# EAGLE design rotary sewing (EAGLE 9.5.2)
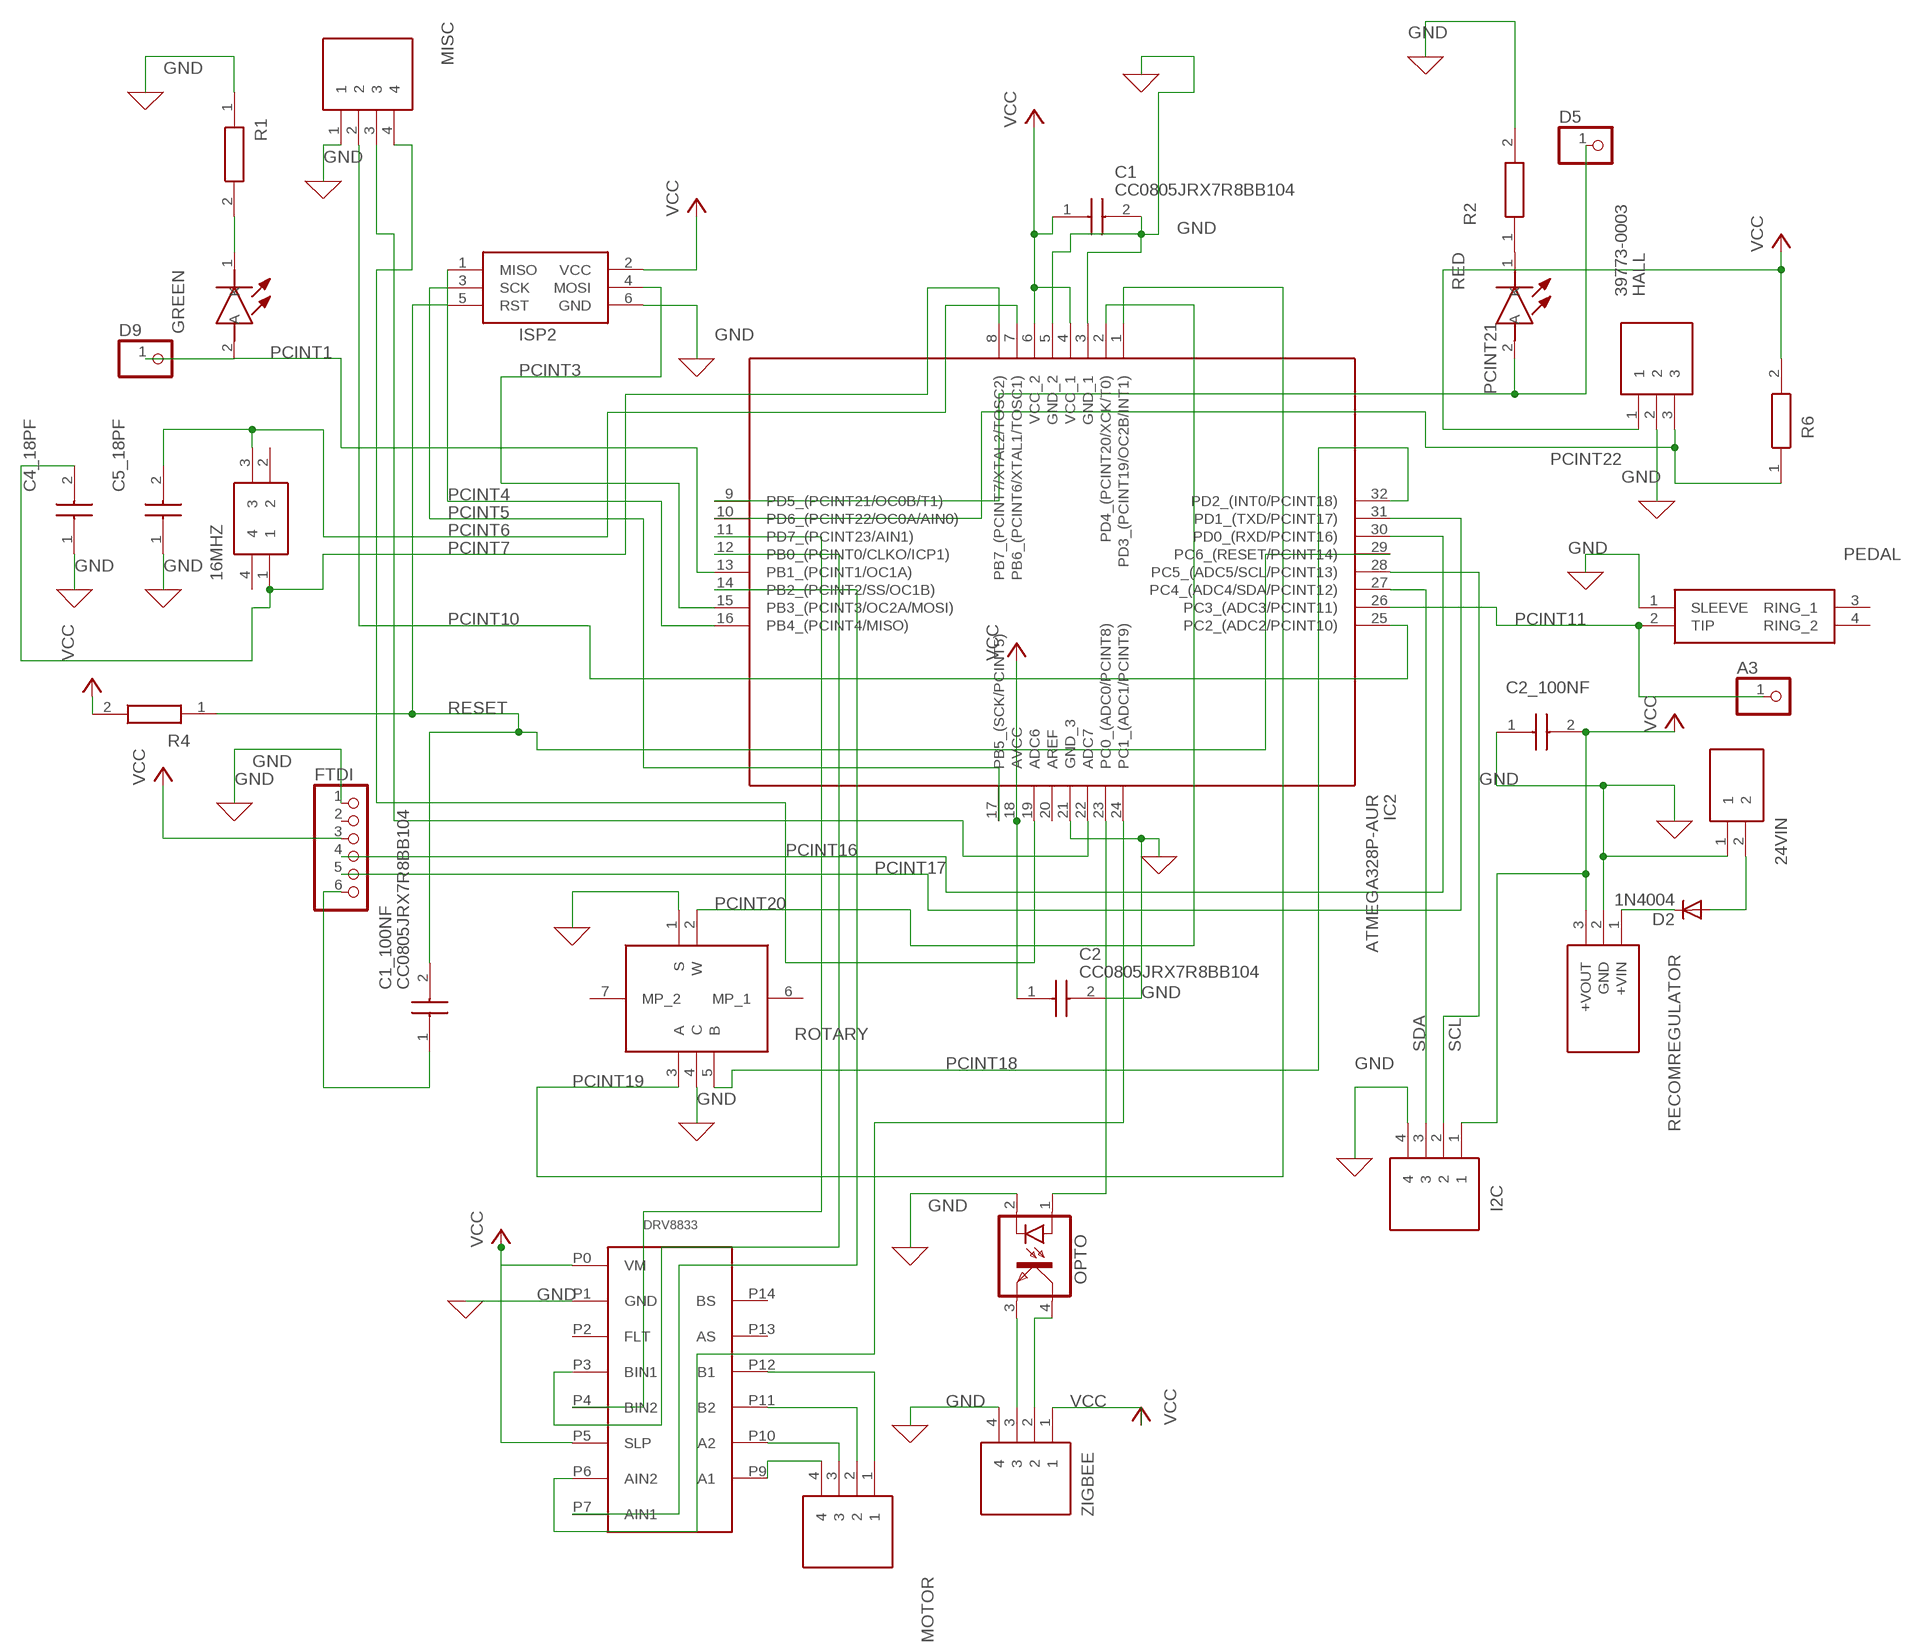
[diagram p0: schematic, sheet 1]

## Parts
16MHZ  403C11E16M00000  [403C1XA32M00000]
24VIN  39773-0002  [SHDR2W110P0X254_1X2_554X650X10]
A3  PINHD-1X1  [1X01]
C1  CC0805JRX7R8BB104  [CAPC2012X135N]
C1_100NF  CC0805JRX7R8BB104  [CAPC2012X135N]
C2  CC0805JRX7R8BB104  [CAPC2012X135N]
C2_100NF  CC0805JRX7R8BB104  [CAPC2012X135N]
C4_18PF  C0805C180J5GACTU  [CAPC2012X88N]
C5_18PF  C0805C180J5GACTU  [CAPC2012X88N]
D2  1N4004  [DO41-10]
D5  PINHD-1X1  [1X01]
D9  PINHD-1X1  [1X01]
DRV8833  DRV8833  [DRV8833]
FTDI  PINHD-1X6  [1X06]
GREEN  LTST-C171GKT  [LEDC2012X90N]
HALL  39773-0003  [SHDR3W80P0X254_1X3_808X650X101]
I2C  39773-0004  [SHDR4W80P0X254_1X4_1062X650X10]
IC2  ATMEGA328P-AUR  [QFP80P900X900X120-32N]
ISP2  AVRISP-6  [AVRISP]
MISC  39773-0004  [SHDR4W80P0X254_1X4_1062X650X10]
MOTOR  39773-0004  [SHDR4W80P0X254_1X4_1062X650X10]
OPTO  PC817  [DIL04]
PEDAL  SJ2-3574A-SMT-TR  [SJ23574ASMTTR]
R1  RMC1_10K1001FTP  [RESC2012X65N]
R2  RMC1_10K1001FTP  [RESC2012X65N]
R4  ERA-6AED103V  [RESC2012X60N]
R6  ERA-6AED103V  [RESC2012X60N]
RECOMREGULATOR  R-78E3.3-1.0  [R-78E3.3-1.0]
RED  LTST-C171KRKT  [LEDM2012X90N]
ROTARY  PEC11L-4220F-S0015  [PEC11L4220FS0015]
ZIGBEE  39773-0004  [SHDR4W80P0X254_1X4_1062X650X10]

## Nets
GND: 24VIN.1 C1.2 C2.2 C2_100NF.1 C4_18PF.1 C5_18PF.1 DRV8833.P1(GND) FTDI.1 HALL.2 I2C.4 IC2.3(GND_1) IC2.5(GND_2) IC2.21(GND_3) ISP2.6(GND) MISC.1 OPTO.2(C) PEDAL.1(SLEEVE) R1.1 R2.2 RECOMREGULATOR.2(GND) ROTARY.1(S) ROTARY.4(C) ZIGBEE.4
N$1: OPTO.3(EMIT) ZIGBEE.3
N$2: IC2.23(PC0_(ADC0/PCINT8)) OPTO.1(A)
N$3: OPTO.4(COL) ZIGBEE.2
N$4: 24VIN.2 D2.A
N$5: R2.1 RED.1(K)
N$6: GREEN.1(K) R1.2
N$7: DRV8833.P9(A1) MOTOR.4
N$8: DRV8833.P10(A2) MOTOR.3
N$9: DRV8833.P11(B2) MOTOR.2
N$10: DRV8833.P12(B1) MOTOR.1
N$11: C1_100NF.1 FTDI.6
N$12: DRV8833.P4(BIN2) IC2.11(PD7_(PCINT23/AIN1))
N$13: D2.C RECOMREGULATOR.1(+VIN)
N$14: DRV8833.P3(BIN1) IC2.12(PB0_(PCINT0/CLKO/ICP1))
N$15: DRV8833.P7(AIN1) IC2.14(PB2_(PCINT2/SS/OC1B))
N$16: DRV8833.P6(AIN2) IC2.24(PC1_(ADC1/PCINT9))
N$17: IC2.22(ADC7) MISC.3
N$19: IC2.19(ADC6) MISC.4
PCINT1: D9.1 GREEN.2(A) IC2.13(PB1_(PCINT1/OC1A))
PCINT3: IC2.15(PB3_(PCINT3/OC2A/MOSI)) ISP2.4(MOSI)
PCINT4: IC2.16(PB4_(PCINT4/MISO)) ISP2.1(MISO)
PCINT5: IC2.17(PB5_(SCK/PCINT5)) ISP2.3(SCK)
PCINT6: 16MHZ.3 C5_18PF.2 IC2.7(PB6_(PCINT6/XTAL1/TOSC1))
PCINT7: 16MHZ.1 C4_18PF.2 IC2.8(PB7_(PCINT7/XTAL2/TOSC2))
PCINT10: IC2.25(PC2_(ADC2/PCINT10)) MISC.2
PCINT11: A3.1 IC2.26(PC3_(ADC3/PCINT11)) PEDAL.2(TIP)
PCINT16: FTDI.4 IC2.30(PD0_(RXD/PCINT16))
PCINT17: FTDI.5 IC2.31(PD1_(TXD/PCINT17))
PCINT18: IC2.32(PD2_(INT0/PCINT18)) ROTARY.5(B)
PCINT19: IC2.1(PD3_(PCINT19/OC2B/INT1)) ROTARY.3(A)
PCINT20: IC2.2(PD4_(PCINT20/XCK/T0)) ROTARY.2(W)
PCINT21: D5.1 IC2.9(PD5_(PCINT21/OC0B/T1)) RED.2(A)
PCINT22: HALL.3 IC2.10(PD6_(PCINT22/OC0A/AIN0)) R6.1
RESET: C1_100NF.2 IC2.29(PC6_(RESET/PCINT14)) ISP2.5(RST) R4.1
SCL: I2C.2 IC2.28(PC5_(ADC5/SCL/PCINT13))
SDA: I2C.3 IC2.27(PC4_(ADC4/SDA/PCINT12))
VCC: C1.1 C2.1 C2_100NF.2 DRV8833.P0(VM) DRV8833.P5(SLP) FTDI.3 HALL.1 I2C.1 IC2.4(VCC_1) IC2.6(VCC_2) IC2.18(AVCC) ISP2.2(VCC) R4.2 R6.2 RECOMREGULATOR.3(+VOUT) ZIGBEE.1
Unconnected: 16MHZ.2 16MHZ.4 DRV8833.P2(FLT) DRV8833.P13(AS) DRV8833.P14(BS) FTDI.2 IC2.20(AREF) PEDAL.3(RING_1) PEDAL.4(RING_2) ROTARY.6(MP_1) ROTARY.7(MP_2)

## Library data of the parts
16MHZ = SamacSys_Parts:403C11E16M00000: Crystals 16MHz 10ppm 20pF Source: Datasheet <https://componentsearchengine.com/Datasheets/1/403C11E16M00000.pdf>; DESCRIPTION: Crystals 16MHz 10ppm 20pF; HEIGHT: 0mm; MANUFACTURER_NAME: CTS; MANUFACTURER_PART_NUMBER: 403C11E16M00000; MOUSER_PART_NUMBER: 774-403C11E16M0; MOUSER_PRICE-STOCK: https://www.mouser.com/Search/Refine.aspx?Keyword=774-403C11E16M0
24VIN = SamacSys_Parts:39773-0002: Fixed Terminal Blocks 2.54mm Eurostyle Fxd TB Mnt PCB 2Ckt Grn Source: Datasheet <https://componentsearchengine.com/Datasheets/1/39773-0002.pdf>; DESCRIPTION: Fixed Terminal Blocks 2.54mm Eurostyle Fxd TB Mnt PCB 2Ckt Grn; HEIGHT: 10mm; MANUFACTURER_NAME: Molex; MANUFACTURER_PART_NUMBER: 39773-0002; MOUSER_PART_NUMBER: 538-39773-0002; MOUSER_PRICE-STOCK: https://www.mouser.com/Search/Refine.aspx?Keyword=538-39773-0002
A3 D5 D9 = adafruit:PINHD-1X1: Pin header 1x1 for 0.1" spacing With round pins
C1 C1_100NF C2 C2_100NF = SamacSys_Parts:CC0805JRX7R8BB104: Multilayer Ceramic Capacitors MLCC - SMD/SMT 100nF 25V X7R 5% Source: Datasheet <https://componentsearchengine.com/Datasheets/1/CC0805JRX7R8BB104.pdf>; DESCRIPTION: Multilayer Ceramic Capacitors MLCC - SMD/SMT 100nF 25V X7R 5%; HEIGHT: 1.35mm; MANUFACTURER_NAME: YAGEO (PHYCOMP); MANUFACTURER_PART_NUMBER: CC0805JRX7R8BB104; MOUSER_PART_NUMBER: 603-CC805JRX7R8BB104; MOUSER_PRICE-STOCK: https://www.mouser.com/Search/Refine.aspx?Keyword=603-CC805JRX7R8BB104
C4_18PF C5_18PF = SamacSys_Parts:C0805C180J5GACTU: CAPACITOR, 0805 18pF +/-5% 50V Source: Datasheet <https://componentsearchengine.com/Datasheets/1/C0805C180J5GACTU.pdf>; DESCRIPTION: CAPACITOR, 0805 18pF +/-5% 50V; HEIGHT: 0.88mm; MANUFACTURER_NAME: Kemet; MANUFACTURER_PART_NUMBER: C0805C180J5GACTU; MOUSER_PART_NUMBER: 80-C0805C180J5G; MOUSER_PRICE-STOCK: https://www.mouser.com/Search/Refine.aspx?Keyword=80-C0805C180J5G
D2 = adafruit:1N4004: DIODE General purpose 1N400x type rectifier (With bigger pads) http://www.ladyada.net/library/pcb/eaglelibrary.html
DRV8833 = customs:DRV8833
FTDI = adafruit:PINHD-1X6: PIN HEADER
GREEN = SamacSys_Parts:LTST-C171GKT: Lite-On LTST-C171GKT, CHIPLED 0805 569 nm Green LED, 2012 (0805) SMD package Source: Datasheet <https://componentsearchengine.com/Datasheets/1/LTST-C171GKT.pdf>; DESCRIPTION: Lite-On LTST-C171GKT, CHIPLED 0805 569 nm Green LED, 2012 (0805) SMD package; HEIGHT: 0.9mm; MANUFACTURER_NAME: Lite-On; MANUFACTURER_PART_NUMBER: LTST-C171GKT; MOUSER_PART_NUMBER: 859-LTST-C171GKT; MOUSER_PRICE-STOCK: https://www.mouser.com/Search/Refine.aspx?Keyword=859-LTST-C171GKT
HALL = SamacSys_Parts:39773-0003: Fixed Terminal Blocks 2.54mm Eurostyle Fxd TB Mnt PCB 3Ckt Grn Source: Datasheet <https://componentsearchengine.com/Datasheets/1/39773-0003.pdf>; DESCRIPTION: Fixed Terminal Blocks 2.54mm Eurostyle Fxd TB Mnt PCB 3Ckt Grn; HEIGHT: 10.1mm; MANUFACTURER_NAME: Molex; MANUFACTURER_PART_NUMBER: 39773-0003; MOUSER_PART_NUMBER: 538-39773-0003; MOUSER_PRICE-STOCK: https://www.mouser.com/Search/Refine.aspx?Keyword=538-39773-0003
I2C MISC MOTOR ZIGBEE = SamacSys_Parts:39773-0004: Fixed Terminal Blocks 2.54mm Eurostyle Fxd TB Mnt PCB 4Ckt Grn Source: Datasheet <https://componentsearchengine.com/Datasheets/1/39773-0004.pdf>; DESCRIPTION: Fixed Terminal Blocks 2.54mm Eurostyle Fxd TB Mnt PCB 4Ckt Grn; HEIGHT: 10.1mm; MANUFACTURER_NAME: Molex; MANUFACTURER_PART_NUMBER: 39773-0004; MOUSER_PART_NUMBER: 538-39773-0004; MOUSER_PRICE-STOCK: https://www.mouser.com/Search/Refine.aspx?Keyword=538-39773-0004
IC2 = SamacSys_Parts:ATMEGA328P-AUR: 8-bit Microcontrollers - MCU AVR 32K FLSH 2K SRAM 1KB EE-20MHz IND Source: Datasheet <https://componentsearchengine.com/Datasheets/1/ATMEGA328P-AUR.pdf>; DESCRIPTION: 8-bit Microcontrollers - MCU AVR 32K FLSH 2K SRAM 1KB EE-20MHz IND; HEIGHT: 1.2mm; MANUFACTURER_NAME: Microchip; MANUFACTURER_PART_NUMBER: ATMEGA328P-AUR; MOUSER_PART_NUMBER: 556-ATMEGA328P-AUR; MOUSER_PRICE-STOCK: https://www.mouser.com/Search/Refine.aspx?Keyword=556-ATMEGA328P-AUR
ISP2 = adafruit:AVRISP: AVR ISP HEADER Standard 6 pin header for AVR programming
OPTO = optocoupler:PC817: SHARP OPTO COUPLER; MPN: PC817X4J000F; OC_FARNELL: 9707727; OC_NEWARK: 97K7059
PEDAL = SamacSys_Parts:SJ2-3574A-SMT-TR: Phone Connectors 3.5mm Audio Jack SMT 4 conductor 0 switch Source: Datasheet <https://componentsearchengine.com/Datasheets/1/SJ2-3574A-SMT-TR.pdf>; DESCRIPTION: Phone Connectors 3.5mm Audio Jack SMT 4 conductor 0 switch; HEIGHT: 5mm; MANUFACTURER_NAME: CUI; MANUFACTURER_PART_NUMBER: SJ2-3574A-SMT-TR; MOUSER_PART_NUMBER: 490-SJ2-3574A-SMT-TR; MOUSER_PRICE-STOCK: https://www.mouser.com/Search/Refine.aspx?Keyword=490-SJ2-3574A-SMT-TR
R1 R2 = SamacSys_Parts:RMC1_10K1001FTP: Thick Film Resistors - SMD 0805 1K00 1% Source: Datasheet <https://componentsearchengine.com/Datasheets/1/RMC1_10K1001FTP.pdf>; DESCRIPTION: Thick Film Resistors - SMD 0805 1K00 1%; HEIGHT: 0.65mm; MANUFACTURER_NAME: Kamaya; MANUFACTURER_PART_NUMBER: RMC1/10K1001FTP; MOUSER_PART_NUMBER: 791-RMC1/10K1001FTP; MOUSER_PRICE-STOCK: https://www.mouser.com/Search/Refine.aspx?Keyword=791-RMC1%2F10K1001FTP
R4 R6 = SamacSys_Parts:ERA-6AED103V: Thin Film Resistors - SMD 0805 10Kohms 25ppm 0.5% AEC-Q200 Source: Datasheet <https://componentsearchengine.com/Datasheets/1/ERA-6AED103V.pdf>; DESCRIPTION: Thin Film Resistors - SMD 0805 10Kohms 25ppm 0.5% AEC-Q200; HEIGHT: 0.6mm; MANUFACTURER_NAME: Panasonic; MANUFACTURER_PART_NUMBER: ERA-6AED103V; MOUSER_PART_NUMBER: 667-ERA-6AED103V; MOUSER_PRICE-STOCK: https://www.mouser.com/Search/Refine.aspx?Keyword=667-ERA-6AED103V
RECOMREGULATOR = SamacSys_Parts:R-78E3.3-1.0: Recom DC-DC Switching Regulator, 7 28V dc Input, 3.3V Output, 1A Source: Datasheet <https://componentsearchengine.com/Datasheets/1/R-78E3.3-1.0.pdf>; DESCRIPTION: Recom DC-DC Switching Regulator, 7 28V dc Input, 3.3V Output, 1A; HEIGHT: mm; MANUFACTURER_NAME: RECOM Power; MANUFACTURER_PART_NUMBER: R-78E3.3-1.0; MOUSER_PART_NUMBER: 919-R-78E3.3-1.0; MOUSER_PRICE-STOCK: https://www.mouser.com/Search/Refine.aspx?Keyword=919-R-78E3.3-1.0
RED = SamacSys_Parts:LTST-C171KRKT: Lite-On LTST-C171KRKT, CHIPLED 0805 631 nm Red LED, 2012 (0805) SMD package Source: Datasheet <https://componentsearchengine.com/Datasheets/1/LTST-C171KRKT.pdf>; DESCRIPTION: Lite-On LTST-C171KRKT, CHIPLED 0805 631 nm Red LED, 2012 (0805) SMD package; HEIGHT: 0.9mm; MANUFACTURER_NAME: Lite-On; MANUFACTURER_PART_NUMBER: LTST-C171KRKT; MOUSER_PART_NUMBER: 859-LTST-C171KRKT; MOUSER_PRICE-STOCK: https://www.mouser.com/Search/Refine.aspx?Keyword=859-LTST-C171KRKT
ROTARY = SamacSys_Parts:PEC11L-4220F-S0015: BOURNS - PEC11L-4220F-S0015 - INCREMENTAL ENCODER, 15 PULSES Source: Datasheet <https://componentsearchengine.com/Datasheets/1/PEC11L-4220F-S0015.pdf>; DESCRIPTION: BOURNS - PEC11L-4220F-S0015 - INCREMENTAL ENCODER, 15 PULSES; HEIGHT: 25mm; MANUFACTURER_NAME: Bourns; MANUFACTURER_PART_NUMBER: PEC11L-4220F-S0015; MOUSER_PART_NUMBER: 652-PEC11L4220FS0015; MOUSER_PRICE-STOCK: https://www.mouser.com/Search/Refine.aspx?Keyword=652-PEC11L4220FS0015

## Board
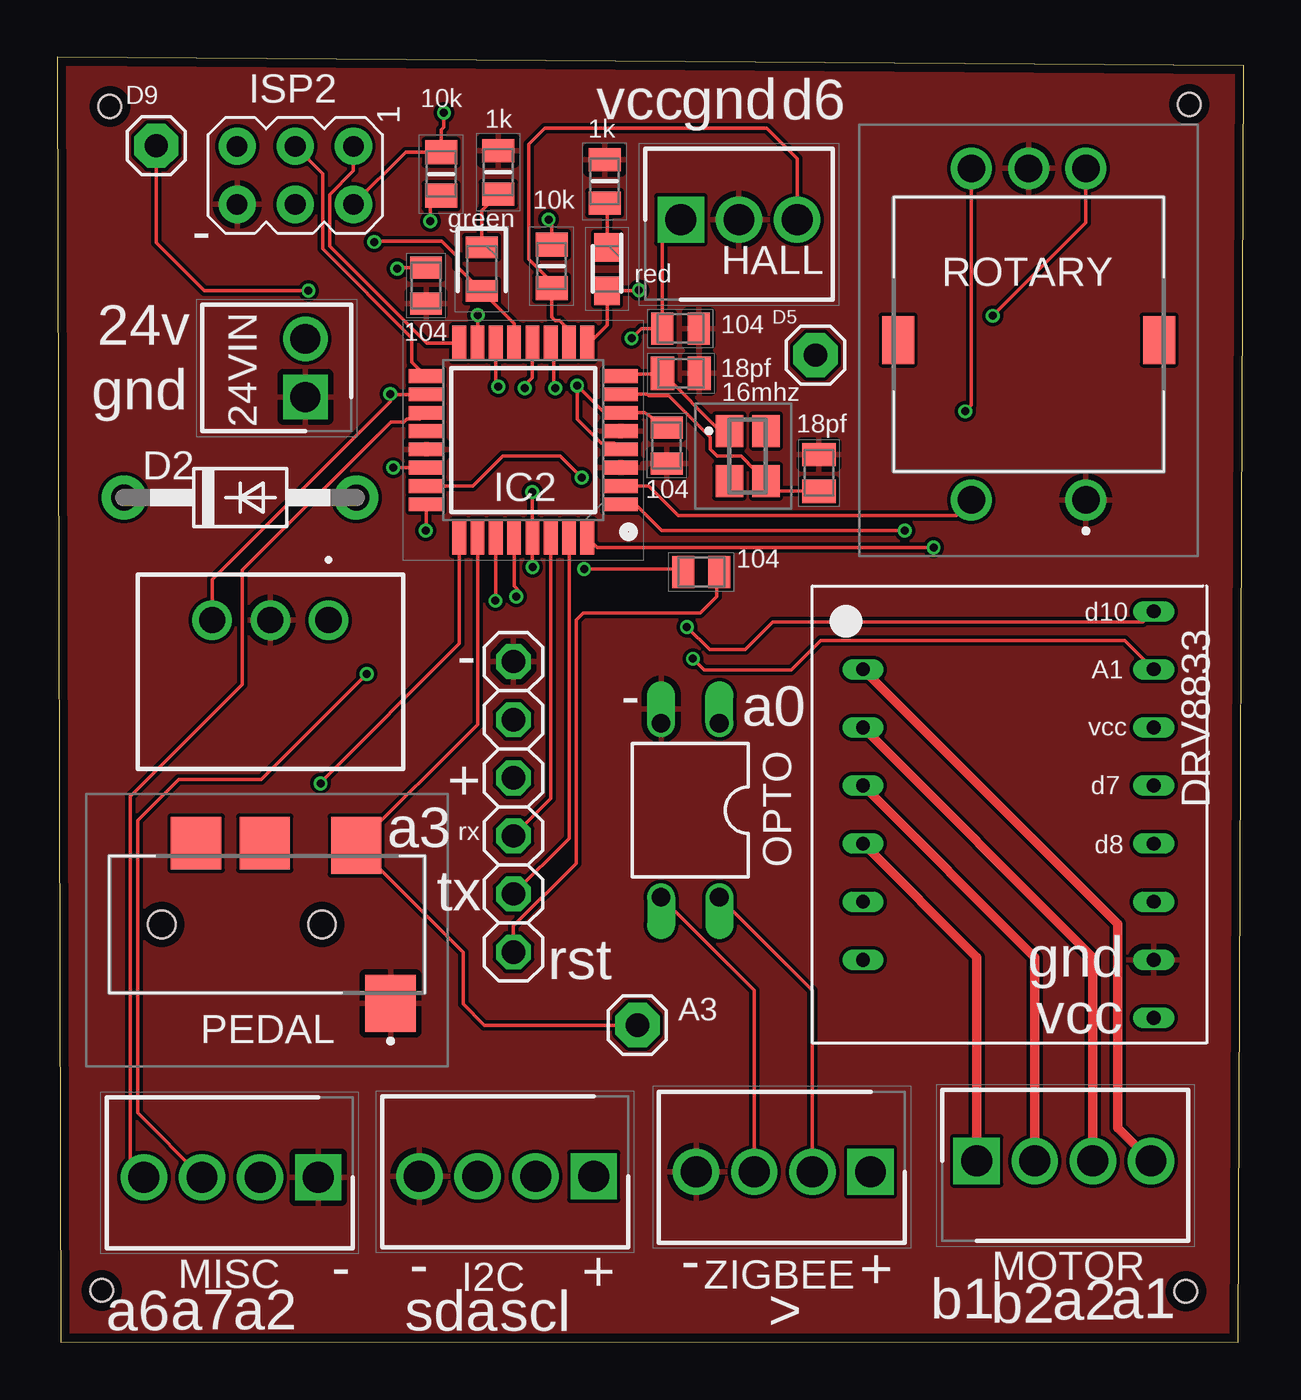
[diagram p1: board, top side]
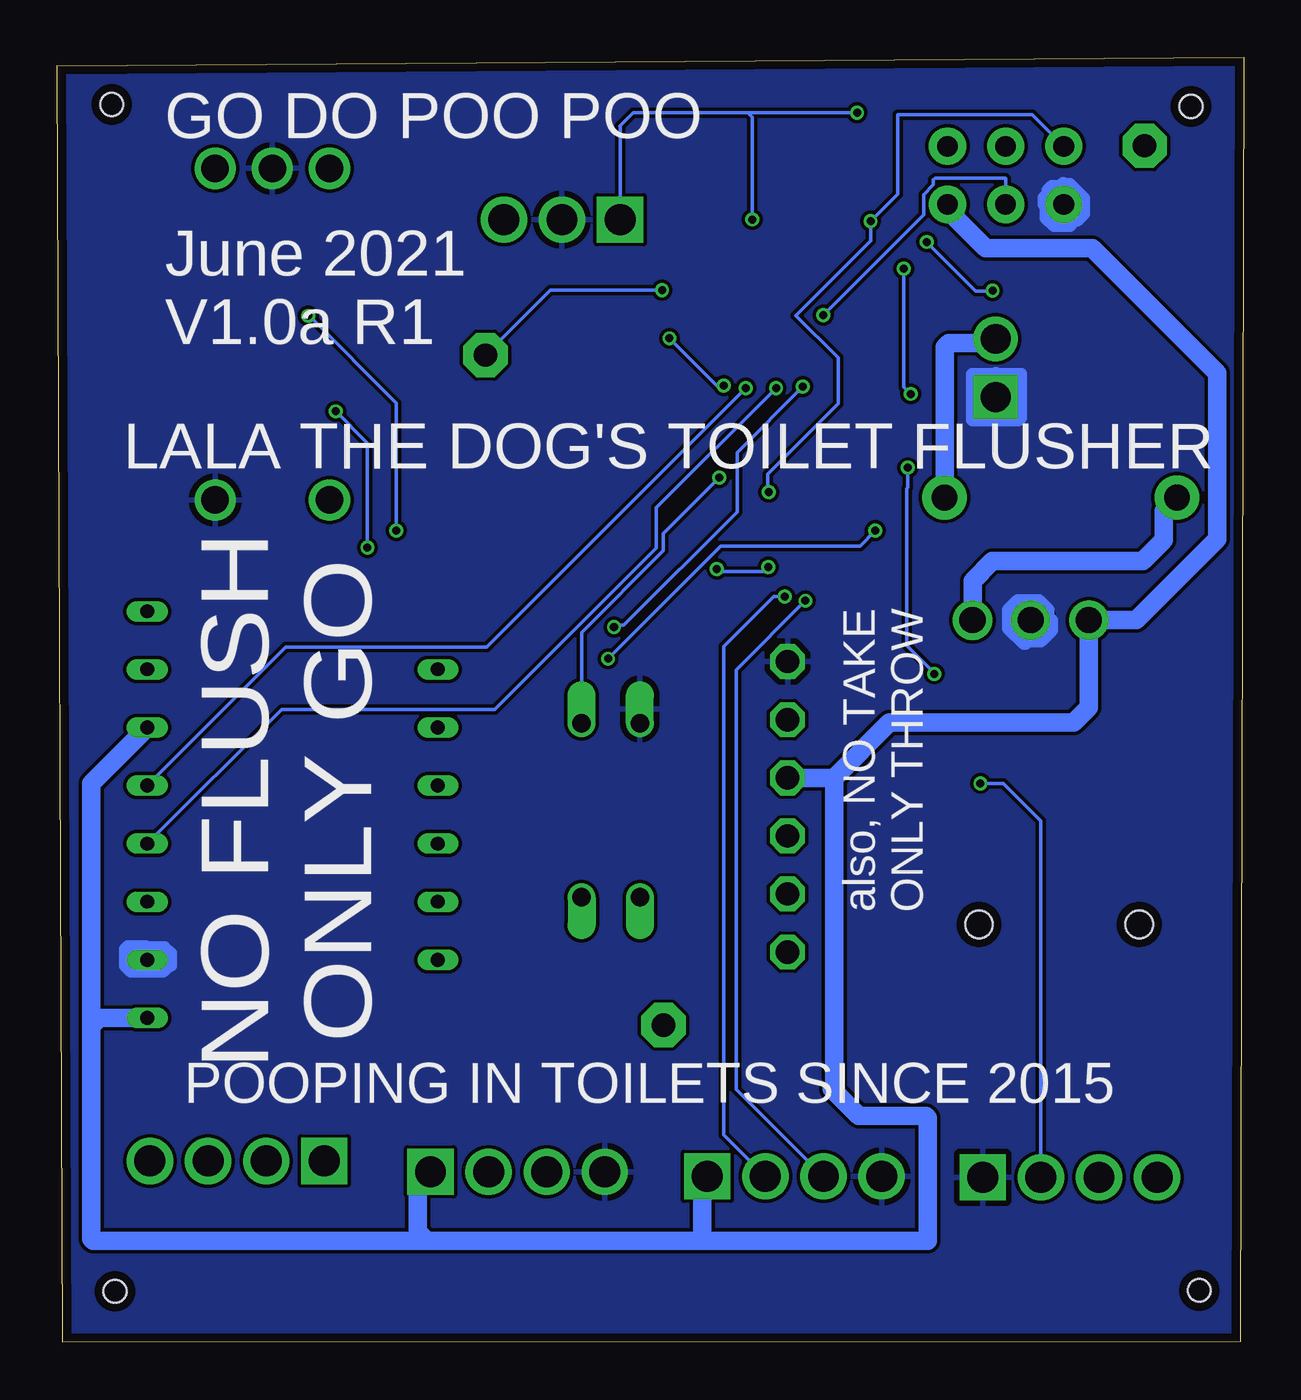
[diagram p2: board, bottom side, seen from below]

Size 51.85 x 56.18 mm. Coordinates in mm from the lower left corner, seen from the top.
Outline: 0.15,0.03 51.61,0 51.86,55.81 0,56.18 0.15,0.03
Copper layers (1*16): Top 0.035559375mm / dielectric 1.6mm / Bottom 0.035559375mm
Design rules "oshpark-2layer": minimum track width 6mil, minimum drill 10mil, track to track 6mil, track to pad 6mil, pad to pad 6mil, via to via 6mil, smd to smd 6mil, copper to edge 15mil, drill to drill 6mil, minimum pad ring 5mil, minimum via ring 5mil, stop-mask expansion 2.5mil, vias tented up to drill 0mil, thermal gap 10mil
Holes 1 mm at 2.3,54.03 1.95,2.27 49.33,2.23 49.47,54.12

### Footprints (pad centres in the part's own frame; a part is rotated, then mirrored left to right if it is on the bottom)
403C1XA32M00000 = smd 1.4 x 1.2: 1 -1.1,-0.8; 2 1.1,-0.8; 3 1.1,0.8; 4 -1.1,0.8
SHDR2W110P0X254_1X2_554X650X10 = drill 1.3 pad 1.95 square: 1 0,0 | drill 1.3 pad 1.95: 2 2.54,0
1X01 = drill 1.016 pad 1.93 octagon: 1 0,0
CAPC2012X135N = smd 0.96 x 1.39: 1 -0.79,0; 2 0.79,0
CAPC2012X88N = smd 1.02 x 1.47: 1 -0.8,0; 2 0.8,0
DO41-10 = drill 1.118 pad 1.93: A 5.08,0; C -5.08,0
DRV8833 = drill 0.6 long: P0 -6.22,8.89; P1 -6.22,6.35; P2 -6.22,3.81; P3 -6.22,1.27; P4 -6.22,-1.27; P5 -6.22,-3.81; P6 -6.22,-6.35; P7 -6.22,-8.89; P9 6.48,-6.35; P10 6.48,-3.81; P11 6.48,-1.27; P12 6.48,1.27; P13 6.48,3.81; P14 6.48,6.35
1X06 = drill 1.016 octagon: 1 -6.35,0; 2 -3.81,0; 3 -1.27,0; 4 1.27,0; 5 3.81,0; 6 6.35,0
LEDC2012X90N = smd 0.95 x 1.4: 1 -0.95,0; 2 0.95,0
SHDR3W80P0X254_1X3_808X650X101 = drill 1.35 pad 2.025 square: 1 0,0 | drill 1.35 pad 2.025: 2 2.54,0; 3 5.08,0
SHDR4W80P0X254_1X4_1062X650X10 = drill 1.35 pad 2.025 square: 1 0,0 | drill 1.35 pad 2.025: 2 2.54,0; 3 5.08,0; 4 7.62,0
QFP80P900X900X120-32N = smd 1.5 x 0.6: 1 -4.25,2.8; 2 -4.25,2; 3 -4.25,1.2; 4 -4.25,0.4; 5 -4.25,-0.4; 6 -4.25,-1.2; 7 -4.25,-2; 8 -4.25,-2.8; 17 4.25,-2.8; 18 4.25,-2; 19 4.25,-1.2; 20 4.25,-0.4; 21 4.25,0.4; 22 4.25,1.2; 23 4.25,2; 24 4.25,2.8 | smd 0.6 x 1.5: 9 -2.8,-4.25; 10 -2,-4.25; 11 -1.2,-4.25; 12 -0.4,-4.25; 13 0.4,-4.25; 14 1.2,-4.25; 15 2,-4.25; 16 2.8,-4.25; 25 2.8,4.25; 26 2,4.25; 27 1.2,4.25; 28 0.4,4.25; 29 -0.4,4.25; 30 -1.2,4.25; 31 -2,4.25; 32 -2.8,4.25
AVRISP = drill 0.9 pad 1.626: 1 -1.27,2.54; 2 1.27,2.54; 3 -1.27,0; 4 1.27,0; 5 -1.27,-2.54; 6 1.27,-2.54
DIL04 = drill 0.813 offset: 1 -1.27,-3.81; 2 1.27,-3.81; 3 1.27,3.81; 4 -1.27,3.81
SJ23574ASMTTR = smd 2.2 x 2.5: 1 5.4,-3.2; 2 3.9,3.7 | smd 2.2 x 2.3: 3 -0.1,3.8; 4 -3.1,3.8 | hole 1.2: -4.6,0.25; 2.4,0.25
RESC2012X65N = smd 1 x 1.4: 1 -0.95,0; 2 0.95,0
RESC2012X60N = smd 1.05 x 1.4: 1 -0.95,0; 2 0.95,0
R-78E3.3-1.0 = drill 1.15 pad 1.7: 1 -2.54,2; 2 0,2; 3 2.54,2
LEDM2012X90N = smd 1.25 x 1.1: 1 -0.95,0; 2 0.95,0
PEC11L4220FS0015 = drill 1.2 pad 1.8: 1 -2.5,6.525; 2 2.5,6.525; 3 -2.5,-7.975; 4 0,-7.975; 5 2.5,-7.975 | smd 1.4 x 2.1: 6 5.7,-0.475; 7 -5.7,-0.475

### Placement (x,y rotation side)
16MHZ  30.18,38.74 270 top
24VIN  10.84,41.33 90 top
A3  25.36,13.87 0 top
C1  26.64,39.21 270 top
C1_100NF  28.15,33.67 180 top
C2  16.12,46.19 270 top
C2_100NF  27.24,44.32 180 top
C4_18PF  27.26,42.36 180 top
C5_18PF  33.29,38.01 270 top
D2  8,36.93 0 top
D5  33.14,43.16 0 top
D9  4.33,52.31 0 top
DRV8833  41.7,23.07 180 top
FTDI  19.94,23.41 270 top
GREEN  18.55,46.91 270 top
HALL  27.26,49.08 0 top
I2C  23.45,7.25 180 top
IC2  20.37,39.44 180 top
ISP2  10.4,51.02 270 top
MISC  11.41,7.21 180 top
MOTOR  40.18,7.93 0 top
OPTO  27.66,23.26 180 top
PEDAL  9.17,18.02 0 top
R1  19.27,51.15 270 top
R2  23.92,50.75 90 top
R4  16.78,51.07 90 top
R6  21.61,47.04 90 top
RECOMREGULATOR  9.31,33.57 180 top
RED  24.03,46.92 270 top
ROTARY  42.45,43.35 180 top
ZIGBEE  35.54,7.45 180 top

### Tracks (layer width: path | path; a pad name or v marks a point on that pad's centre or on a via)
GND
  Bottom 0.508: ISP2.6 7.87,50.63 7.84,50.65 7.61,50.65 6.98,50.02 6.98,49.32 7.26,49.03 7.36,49.03 7.54,48.86 7.54,48.84 7.59,48.79 8.31,48.79 8.67,49.15 8.67,49.65 8.76,49.75 8.76,50.04 8.59,50.21 8.59,50.36 8.39,50.56 8.03,50.56 7.89,50.7 | 24VIN.1 10.84,42.35 | 10.84,42.35 10.85,42.35 | 10.85,42.35 11.87,42.35 11.88,42.34 11.88,40.31 11.87,40.3 9.82,40.3 9.73,40.39 9.73,42.35 10.84,42.35 | 10.85,42.35 10.84,42.36 10.84,42.39 | RECOMREGULATOR.2 9.31,32.46 8.94,32.46 8.52,32.04 8.52,31.73 8.37,31.58 8.37,31.11 8.85,30.63 9.42,30.63 9.53,30.52 9.62,30.52 10.31,31.21 10.31,31.88 10.32,31.89 10.32,32.03 9.89,32.45 9.34,32.45 | DRV8833.P1 47.92,17.26 48,17.33 48.77,17.33 48.9,17.2 48.9,16.45 48.64,16.19 47.22,16.19 46.95,16.46 46.87,16.46 46.87,17.02 47.15,17.29 47.9,17.29
  pour Bottom: -0.04,0.07 51.56,0.07 51.56,56.09 -0.04,56.09
  pour Top: 0.06,0.23 51.45,0.23 51.45,56.24 -0.04,56.3
N$1
  Top 0.152: OPTO.3 30.46,15.38 ZIGBEE.3
N$2  (via drill 0.35)
  Top 0.152: IC2.23 18.17,37.44 19.48,38.74 21.99,38.74 v22.93,37.8 | v22.93,37.8
  Bottom 0.152: v22.93,37.8 25.37,35.36 25.37,34.6 28.93,31.04 OPTO.1
N$3
  Top 0.152: OPTO.4 33,15.38 ZIGBEE.2
N$4
  Bottom 0.813: 24VIN.2 11.03,43.68 12.89,43.68 13.08,43.5 D2.A
N$5
  Top 0.152: R2.1 24.03,49.69 RED.1
N$6
  Top 0.152: GREEN.1 18.55,49.48 R1.2
N$7
  Top 0.406: DRV8833.P9 46.34,18.29 46.34,9.38 MOTOR.4
N$8
  Top 0.406: DRV8833.P10 45.26,16.84 MOTOR.3
N$9
  Top 0.406: DRV8833.P11 42.72,16.84 MOTOR.2
N$10
  Top 0.406: DRV8833.P12 40.18,16.84 MOTOR.1
N$11
  Top 0.152: C1_100NF.1 28.82,33.55 28.82,32.6 28.1,31.88 22.99,31.88 22.67,31.57 22.67,20.93 19.94,18.2 FTDI.6
N$12  (via drill 0.35)
  Top 0.152: IC2.11 21.7,43.55 21.7,41.78 v21.76,41.72
  Bottom 0.152: v21.76,41.72 33.08,30.4 41.86,30.4 DRV8833.P4
N$13
  Bottom 0.813: D2.C 3.5,36.34 3.5,35.06 4.41,34.15 10.99,34.15 11.85,33.29 RECOMREGULATOR.1
N$14  (via drill 0.35)
  Top 0.152: IC2.12 20.77,42.17 20.38,41.78 v20.44,41.72
  Bottom 0.152: v20.44,41.72 25.67,36.49 25.67,34.73 32.74,27.67 42.05,27.67 DRV8833.P3
N$15  (via drill 0.35)
  Top 0.152: IC2.14 19.17,41.95 19.15,41.93 19.15,41.89 v19.27,41.78 | v27.52,31.28 28.51,30.29 30.07,30.29 31.27,31.49 47.45,31.49 DRV8833.P7
  Bottom 0.152: v19.27,41.78 22.14,38.9 22.14,36.29 27.09,31.35 27.5,31.35 27.52,31.32 v27.52,31.28
N$16  (via drill 0.35)
  Top 0.152: IC2.24 16.12,35.5 v16.1,35.49 | v27.78,29.89 28.28,29.39 32.07,29.39 33.36,30.68 46.65,30.68 DRV8833.P6
  Bottom 0.152: v16.1,35.49 16.77,34.82 22.85,34.82 v27.78,29.89
N$17  (via drill 0.35)
  Top 0.152: IC2.22 v14.69,38.23 | v13.53,29.22 8.92,24.61 5.31,24.61 3.51,22.81 3.51,10.02 MISC.3
  Bottom 0.152: v14.69,38.23 14.69,37.37 14.74,37.32 14.74,30.47 13.51,29.24 v13.53,29.22
N$19
  Top 0.152: IC2.19 15.85,40.37 15.27,40.37 15.15,40.24 14.57,40.24 8.1,33.76 8.1,28.77 3.19,23.86 3.19,7.8 MISC.4
PCINT1  (via drill 0.35)
  Top 0.152: IC2.13 19.98,43.7 19.98,44.54 GREEN.2 17.49,47.03 17.49,47.45 16.8,48.14 13.89,48.14 v13.85,48.11 | v10.98,45.98 6.42,45.98 4.33,48.07 D9.1
  Bottom 0.152: v13.85,48.11 11.7,45.96 10.98,45.96 v10.98,45.98
PCINT3  (via drill 0.35)
  Top 0.152: v18.38,44.91 v18.38,44.9 IC2.15
  Bottom 0.152: v18.38,44.91 13.99,49.31 13.99,50.18 13.56,50.6 13.56,50.82 13.49,50.89 10.42,50.89 10.41,50.88 ISP2.4
PCINT4
  Top 0.152: IC2.16 16.15,43.69 11.9,47.93 11.9,50.18 12.95,51.22 ISP2.1
PCINT5
  Top 0.152: ISP2.3 11.6,51.09 11.6,47.8 15.49,43.91 15.49,42.86 IC2.17
PCINT6
  Top 0.152: IC2.7 24.64,41.46 25.79,41.46 25.86,41.4 26.73,41.4 28.55,39.59 28.55,39.05 28.85,38.74 29.9,38.74 30.2,38.44 30.2,38.41 16MHZ.3 31.41,37.21 C5_18PF.2
PCINT7
  Top 0.152: 16MHZ.1 28.98,39.84 C4_18PF.2 26.42,42.32 24.7,42.32 IC2.8
PCINT10  (via drill 0.35)
  Top 0.152: v11.51,24.44 11.49,24.46 17.57,30.54 IC2.25 | v11.51,24.44
  Bottom 0.152: v11.51,24.44 10.52,24.44 8.87,22.79 MISC.2
PCINT11
  Top 0.152: IC2.26 18.37,27.02 PEDAL.2 17.75,17.04 17.75,14.79 18.67,13.87 A3.1
PCINT16
  Top 0.152: FTDI.4 21.57,23.77 IC2.30
PCINT17
  Top 0.152: FTDI.5 22.37,22.03 IC2.31
PCINT18  (via drill 0.35)
  Top 0.152: v39.68,40.7 39.95,40.98 ROTARY.5 | v38.3,34.75 23.61,34.75 IC2.32
  Bottom 0.152: v38.3,34.75 38.3,39.32 v39.68,40.7 | v39.68,40.7
PCINT19  (via drill 0.35)
  Top 0.152: v37.03,35.49 26.41,35.49 25.26,36.64 IC2.1 | v40.89,44.88 44.95,48.94 ROTARY.3
  Bottom 0.152: v37.03,35.49 37.03,41.06 40.84,44.88 v40.89,44.88
PCINT20
  Top 0.152: ROTARY.2 39.28,36.15 27.14,36.15 25.85,37.44 IC2.2
PCINT21  (via drill 0.35)
  Top 0.152: IC2.9 23.25,43.69 24.03,44.47 RED.2 25.28,45.97 25.29,45.96 25.39,45.96 v25.42,46
  Bottom 0.152: v25.42,46 30.3,46 D5.1
PCINT22
  Top 0.152: HALL.3 32.34,51.74 31,53.07 21.31,53.07 20.6,52.37 20.6,47.35 21.61,46.34 R6.1 21.61,44.82 21.76,44.66 21.96,44.66 22.34,44.29 22.38,44.29 22.38,43.7 IC2.10
RESET  (via drill 0.35)
  Top 0.152: v16.31,49.01 16.31,49.65 R4.1 | v20.77,33.9 20.74,33.93 20.77,33.95 IC2.29 20.77,37.15 v20.76,37.17 | v20.77,33.9 | v23.02,33.81 27.22,33.81 C1_100NF.2
  Bottom 0.152: v23.02,33.81 22.91,33.7 20.97,33.7 v20.77,33.9 | v20.76,37.17 20.79,37.2 20.79,37.96 17.73,41.03 17.73,43.05 19.57,44.89 16.3,48.16 16.3,49 v16.31,49.01 15.13,50.19 15.13,53.68 9.25,53.68 ISP2.5
SCL  (via drill 0.35)
  Top 0.152: IC2.28 19.97,33.06 20.24,32.79 v20.06,32.61
  Bottom 0.152: v20.06,32.61 20.53,32.61 22.73,30.41 22.73,9.08 I2C.2
SDA  (via drill 0.35)
  Top 0.152: IC2.27 19.17,32.51 19.11,32.46 v19.15,32.42
  Bottom 0.152: v19.15,32.42 22.18,29.39 22.18,11.07 I2C.3
VCC  (via drill 0.35)
  Top 0.152: v25.1,43.89 25.53,44.32 C2_100NF.2 26.45,48.27 HALL.1 | v21.47,49.09 21.61,48.95 R6.2 | IC2.18 14.64,41.44 14.61,41.46 v14.56,41.46 14.56,41.12 6.77,33.34 RECOMREGULATOR.3 | C1.1 25.67,40.64 IC2.6 23.9,40.64 v22.72,41.82 22.72,40.36 23.77,39.31 24.35,39.31 IC2.4 | C2.1 14.9,46.98 v14.86,46.94 | v16.9,53.75 16.9,53.13 16.78,53.01 R4.2 15.22,52.02 ISP2.2
  Bottom 0.152: 27.27,53.16 27.26,53.14 HALL.1 | 27.27,53.16 | 27.27,53.16 26.67,53.76 21.68,53.76 21.67,53.75 | v21.47,49.09 21.47,53.56 21.67,53.75 | v14.86,46.94 14.86,41.77 v14.56,41.46 | v25.1,43.89 23.03,41.82 v22.72,41.82 | v16.9,53.75 21.67,53.75
  Bottom 0.813: FTDI.3 17.9,24.68 | 17.9,24.68 15.49,27.09 7.44,27.09 6.77,27.76 RECOMREGULATOR.3 4.7,31.57 1.16,35.11 1.16,42.37 6.63,47.84 11.28,47.84 12.95,49.5 ISP2.2 | 17.9,24.68 17.9,11.17 18,11.07 16.83,9.9 13.89,9.9 13.8,9.82 13.8,4.44 23.67,4.44 | 23.67,4.44 23.67,7.03 I2C.1 | 23.67,4.44 35.7,4.44 | 35.7,4.44 36.09,4.83 36.09,6.91 ZIGBEE.1 | 35.7,4.44 50.28,4.44 50.37,4.53 50.37,13.83 | 50.37,13.83 50.37,24.43 DRV8833.P5 | DRV8833.P0 50.02,14.18 50.37,13.83

### Text on the board
tPlace: 10k | vcc | gnd | 1k | 1k | 10k | green | red | 24v | 104 | 104 | 18pf | gnd | 16mhz | 18pf | 104 | 104 | rx | tx | rst | sda | scl
tNames: d6 | - | d10 | - | A1 | - | a0 | vcc | + | d7 | a3 | d8 | gnd | vcc | - | - | - | + | + | a6 | a7 | a2 | > | b1 | b2 | a2 | a1
bNames: GO DO POO POO / / June 2021 / V1.0a R1 | LALA THE DOG'S TOILET FLUSHER | also, NO TAKE / ONLY THROW | NO FLUSH / ONLY GO | POOPING IN TOILETS SINCE 2015